# Altium project PCB_Project.PrjPcb
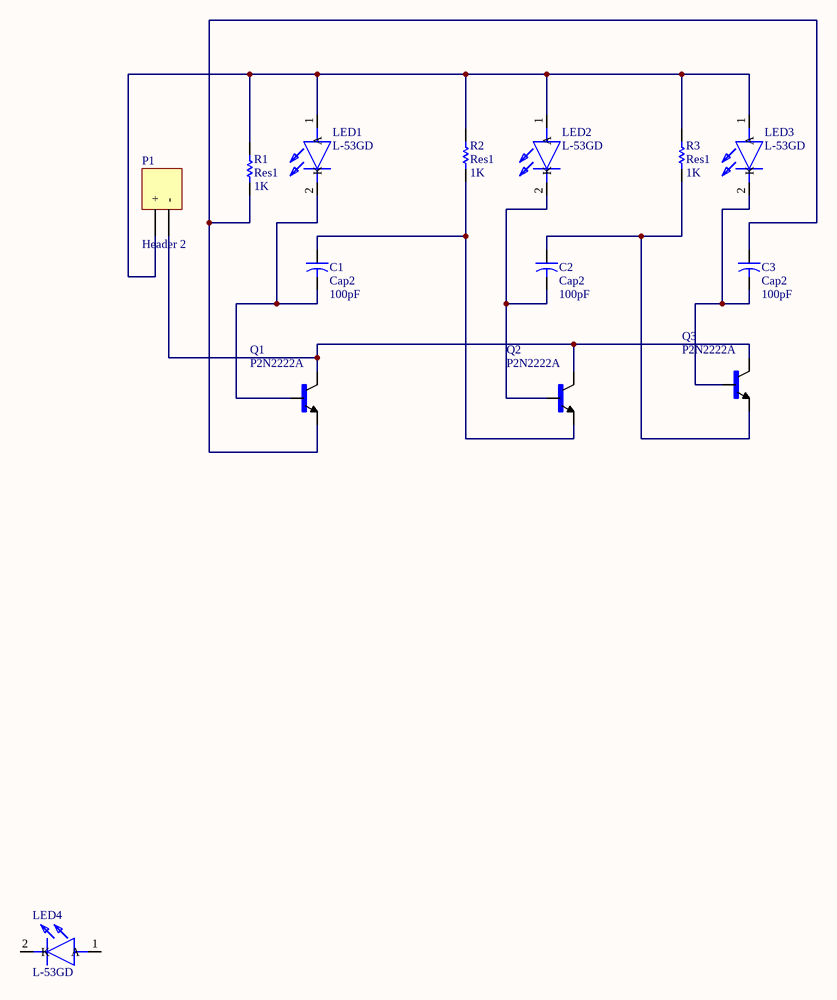
[diagram p0: Sheet1.SchDoc]
1 sheet, 14 parts. Net scope: global (net labels, ports and power ports of the same name join across sheets).
Board file: PCB1.PcbDoc

## Sheet Sheet1.SchDoc
size Letter

### Parts
C1  Cap2  value 100pF  [CAPR5-4X5]
C2  Cap2  value 100pF  [CAPR5-4X5]
C3  Cap2  value 100pF  [CAPR5-4X5]
LED1  L-53GD  [L-53GD]
LED2  L-53GD  [L-53GD]
LED3  L-53GD  [L-53GD]
LED4  L-53GD  [L-53GD]
P1  Header 2  [HDR1X2]
Q1  P2N2222A  [*TO92]
Q2  P2N2222A  [*TO92]
Q3  P2N2222A  [*TO92]
R1  Res1  value 1K  [AXIAL-0.3]
R2  Res1  value 1K  [AXIAL-0.3]
R3  Res1  value 1K  [AXIAL-0.3]

### Nets
NetC1_1: C1.1 Q2.1(E) R2.1
NetC1_2: C1.2 LED1.2(K) Q1.2(B)
NetC2_1: C2.1 Q3.1(E) R3.1
NetC2_2: C2.2 LED2.2(K) Q2.2(B)
NetC3_1: C3.1 Q1.1(E) R1.1
NetC3_2: C3.2 LED3.2(K) Q3.2(B)
NetLED1_1: LED1.1(A) LED2.1(A) LED3.1(A) P1.1(+) R1.2 R2.2 R3.2
NetP1_2: P1.2(-) Q1.3(C) Q2.3(C) Q3.3(C)

Not connected (* = marked no-connect by the designer): LED4 1(A) 2(K)

### Library data of the parts
C1-C3 = Cap2: Capacitor; Published: 23-Sep-2002; PackageReference: CAPR5-4X5; Publisher: Altium Limited; PackageDescription: Capacitor; 2 Leads
LED1-LED4 = L-53GD: LED; Manufacturer_Name: Kingbright; Allied_Number: 70424261; Datasheet Link: http://docs-emea.rs-online.com/webdocs/151e/0900766b8151e408.pdf; Manufacturer_Part_Number: L-53GD; Mouser Part Number: N/A; Mouser Price/Stock: https://www.mouser.com/Search/Refine.aspx?Keyword=N%2FA; RS Part Number: 2286004A; RS Price/Stock: http://uk.rs-online.com/web/p/products/2286004A; Allied Price/Stock: http://www.alliedelec.com/kingbright-l-53gd/70424261/
P1 = Header 2: Header, 2-Pin; LatestRevisionDate: 17-Jul-2002; LatestRevisionNote: Re-released for DXP Platform.; Publisher: Altium Limited
Q1-Q3 = P2N2222A: MF: ON Semiconductor; SnapEDA_Link: https://www.snapeda.com/parts/P2N2222A/ON%20Semiconductor/view-part/?ref=snap; Availability: Unavailable; Package: TO-92 NXP Semiconductors; Price: None; MP: P2N2222A; Value: *
R1-R3 = Res1: Resistor; Published: 8-Jun-2000; LatestRevisionDate: 17-Jul-2002; LatestRevisionNote: Re-released for DXP Platform.; PackageReference: AXIAL-0.3; Publisher: Altium Limited; PackageDescription: Axial Device, Thru-Hole; 2 Leads; 0.3 in Pin Spacing